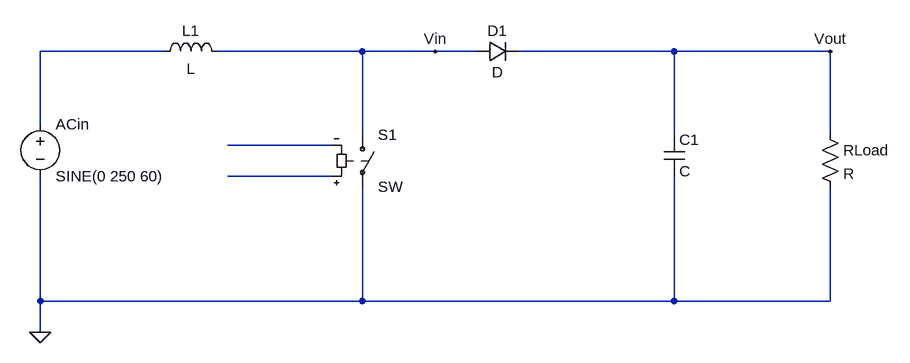
[diagram p0: schematic Boost SMPS.asc]
Boost SMPS.asc, the LTspice schematic file:
Version 4
SHEET 1 1360 680
WIRE 240 16 48 16
WIRE 544 16 320 16
WIRE 656 16 544 16
WIRE 720 16 656 16
WIRE 1024 16 784 16
WIRE 1264 16 1024 16
WIRE 48 128 48 16
WIRE 544 144 544 16
WIRE 1024 144 1024 16
WIRE 1264 144 1264 16
WIRE 496 160 336 160
WIRE 496 208 336 208
WIRE 48 400 48 208
WIRE 544 400 544 224
WIRE 544 400 48 400
WIRE 1024 400 1024 208
WIRE 1024 400 544 400
WIRE 1264 400 1264 224
WIRE 1264 400 1024 400
WIRE 48 448 48 400
FLAG 1264 16 Vout
FLAG 48 448 0
FLAG 656 16 Vin
SYMBOL voltage 48 112 R0
WINDOW 123 0 0 Left 0
WINDOW 39 0 0 Left 0
SYMATTR InstName ACin
SYMATTR Value SINE(0 250 60)
SYMBOL ind 224 32 R270
WINDOW 0 32 56 VTop 2
WINDOW 3 5 56 VBottom 2
SYMATTR InstName L1
SYMBOL diode 720 32 R270
WINDOW 0 32 32 VTop 2
WINDOW 3 0 32 VBottom 2
SYMATTR InstName D1
SYMBOL cap 1008 144 R0
SYMATTR InstName C1
SYMBOL res 1248 128 R0
SYMATTR InstName RLoad
SYMBOL sw 544 128 R0
SYMATTR InstName S1

The netlist it stands for:
* Boost SMPS.asc
V§ACin N001 0 SINE(0 250 60)
L1 N001 Vin L
D1 Vin Vout D
C1 Vout 0 C
RLoad Vout 0 R
S1 Vin 0 N003 N002 SW
.model D D
.lib standard.dio
.backanno
.end